# Altium schematic sheet DI.SchDoc
size A; SheetNumber: 4; SheetTotal: 13
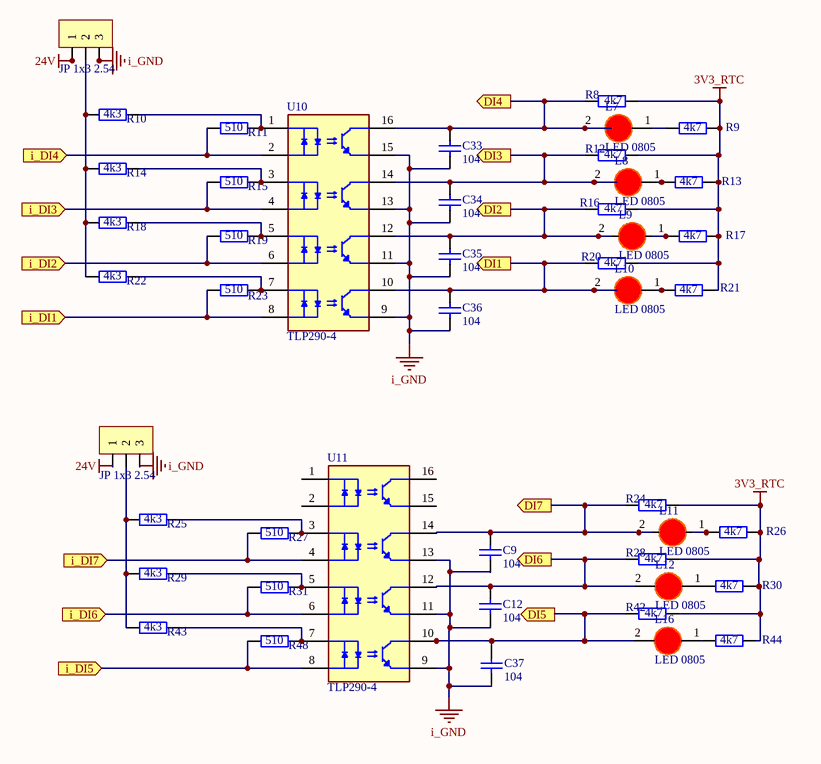
[diagram p0: DI.SchDoc]

## Parts
C9  104  [0603_Cap]
C12  104  [0603_Cap]
C33  104  [0603_Cap]
C34  104  [0603_Cap]
C35  104  [0603_Cap]
C36  104  [0603_Cap]
C37  104  [0603_Cap]
JP3  JP 1x3 2.54  [JP 1x3 DT]
JP4  JP 1x3 2.54  [JP 1x3 DT]
L7  LED 0805  [LED-1206-Red]
L8  LED 0805  [LED-1206-Red]
L9  LED 0805  [LED-1206-Red]
L10  LED 0805  [LED-1206-Red]
L11  LED 0805  [LED-1206-Red]
L12  LED 0805  [LED-1206-Red]
L16  LED 0805  [LED-1206-Red]
R8  4k7  [0603_Res]
R9  4k7  [0603_Res]
R10  4k3  [0603_Res]
R11  510  [0603_Res]
R12  4k7  [0603_Res]
R13  4k7  [0603_Res]
R14  4k3  [0603_Res]
R15  510  [0603_Res]
R16  4k7  [0603_Res]
R17  4k7  [0603_Res]
R18  4k3  [0603_Res]
R19  510  [0603_Res]
R20  4k7  [0603_Res]
R21  4k7  [0603_Res]
R22  4k3  [0603_Res]
R23  510  [0603_Res]
R24  4k7  [0603_Res]
R25  4k3  [0603_Res]
R26  4k7  [0603_Res]
R27  510  [0603_Res]
R28  4k7  [0603_Res]
R29  4k3  [0603_Res]
R30  4k7  [0603_Res]
R31  510  [0603_Res]
R42  4k7  [0603_Res]
R43  4k3  [0603_Res]
R44  4k7  [0603_Res]
R48  510  [0603_Res]
U10  TLP290-4  [OPTO_TLP290-4]
U11  TLP290-4  [OPTO_TLP290-4]

## Ports
DI1 (out), DI2 (out), DI3 (out), DI4 (out), DI5 (out), DI6 (out), DI7 (out), i_DI1 (in), i_DI2 (in), i_DI3 (in), i_DI4 (in), i_DI5 (in), i_DI6 (in), i_DI7 (in)

## Nets
3V3_RTC: R8.2 R9.2 R12.2 R13.2 R16.2 R17.2 R20.2 R21.2 R24.2 R26.2 R28.2 R30.2 R42.2 R44.2
24V: JP3.1 JP4.1
i_GND: C9.2 C12.2 C33.2 C34.2 C35.2 C36.2 C37.2 JP3.3 JP4.3 U10.9 U10.11 U10.13 U10.15 U11.9 U11.11 U11.13
DI1: C36.1 L10.2(K) R20.1 U10.10 ; port DI1
DI2: C35.1 L9.2(K) R16.1 U10.12 ; port DI2
DI3: C34.1 L8.2(K) R12.1 U10.14 ; port DI3
DI4: C33.1 L7.2(K) R8.1 U10.16 ; port DI4
DI5: C37.1 L16.2(K) R42.1 U11.10 ; port DI5
DI6: C12.1 L12.2(K) R28.1 U11.12 ; port DI6
DI7: C9.1 L11.2(K) R24.1 U11.14 ; port DI7
i_DI1: R23.2 U10.8 ; port i_DI1
i_DI2: R19.2 U10.6 ; port i_DI2
i_DI3: R15.2 U10.4 ; port i_DI3
i_DI4: R11.2 U10.2 ; port i_DI4
i_DI5: R48.2 U11.8 ; port i_DI5
i_DI6: R31.2 U11.6 ; port i_DI6
i_DI7: R27.2 U11.4 ; port i_DI7
NetJP3_2: JP3.2 R10.1 R14.1 R18.1 R22.1
NetJP4_2: JP4.2 R25.1 R29.1 R43.1
NetL7_1: L7.1(A) R9.1
NetL8_1: L8.1(A) R13.1
NetL9_1: L9.1(A) R17.1
NetL10_1: L10.1(A) R21.1
NetL11_1: L11.1(A) R26.1
NetL12_1: L12.1(A) R30.1
NetL16_1: L16.1(A) R44.1
NetR10_2: R10.2 R11.1 U10.1
NetR14_2: R14.2 R15.1 U10.3
NetR18_2: R18.2 R19.1 U10.5
NetR22_2: R22.2 R23.1 U10.7
NetR25_2: R25.2 R27.1 U11.3
NetR29_2: R29.2 R31.1 U11.5
NetR43_2: R43.2 R48.1 U11.7

Not connected (* = marked no-connect by the designer): U11 1 2 15 16

## Library data of the parts
C9 C12 C33-C37 = Ceramic Capacitor: Chung_Loai: Dán; Don_Vi: Con; So_Chan: 2; Ten_Linh_Kien: Tụ 0805 104-100nF 10% 50V; Ma_Hang: MH004551; Kieu_Chan: *
JP3 JP4 = JP 1x3 2.54 Duc Thang: Cắm; Ten_Linh_Kien: Jump Đơn Đực 2.54MM 1x40P Thẳng 11MM; Don_Vi: Con; Ma_Hang: MH000903; Ghi_Chu: *; Kieu_Chan: *; Chung_Loai: Cắm
L7-L12 L16 = LED 1206 Do: Dán; Don_Vi: Con; Ma_Hang: MH002334; Ten_Linh_Kien: LED1206 Màu Đỏ (Red); Ghi_Chu: *; Kieu_Chan: *; Chung_Loai: Dán
R8-R31 R42-R44 R48 = Resistor: Chung_Loai: Dán; Don_Vi: Con; So_Chan: 2; Ten_Linh_Kien: Trở 0805 1% 1k; Ma_Hang: MH005468; Kieu_Chan: *
U10 U11 = TLP290-4: Optoisolator Transistor Output 2500Vrms 4 Channel 16-SO; MF: Toshiba Semiconductor; Value: *; SnapEDA_Link: https://www.snapeda.com/parts/TLP290-4/Toshiba+Semiconductor+and+Storage/view-part/?ref=snap; MP: TLP290-4; Check_prices: https://www.snapeda.com/parts/TLP290-4/Toshiba+Semiconductor+and+Storage/view-part/?ref=eda; Availability: Not in stock; Price: None; Package: SOIC-16 Toshiba